# Altium schematic sheet INCAM.SchDoc
size A4
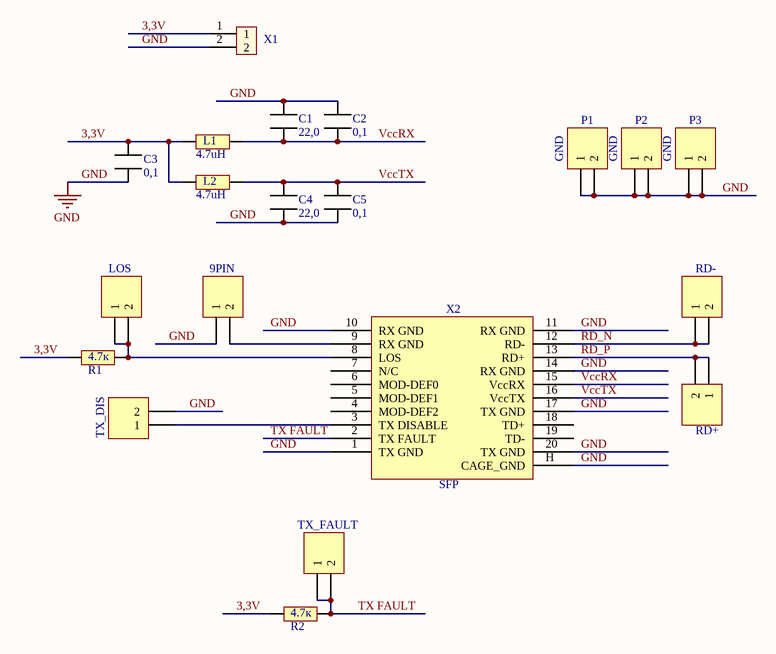
[diagram p0: INCAM.SchDoc]

## Parts
9PIN  Header 2  [HDR1X2]  (value not drawn)
C1  22,0  [Cap_BIG]
C2  0,1  [CAP_SMALL]
C3  0,1  [CAP_SMALL]
C4  22,0  [Cap_BIG]
C5  0,1  [CAP_SMALL]
L1  4.7uH  [RES]
L2  4.7uH  [RES]
LOS  Header 2  [HDR1X2]  (value not drawn)
P1  GND  [HDR1X2]
P2  GND  [HDR1X2]
P3  GND  [HDR1X2]
R1  4.7к  [RES]
R2  4.7к  [RES]
RD+  Header 2  [HDR1X2]  (value not drawn)
RD-  Header 2  [HDR1X2]  (value not drawn)
TX_DIS  Header 2  [HDR1X2]  (value not drawn)
TX_FAULT  Header 2  [HDR1X2]  (value not drawn)
X1  KL_2  [KLEMMNIK_2]  (value not drawn)
X2  SFP  [SFP-20pin]

## Nets
GND: 9PIN.1 C1.2 C2.2 C3.1 C4.1 C5.1 P1.1 P1.2 P2.1 P2.2 P3.1 P3.2 TX_DIS.2 X1.2 X2.1(TX_GND) X2.10(RX_GND) X2.11(RX_GND) X2.14(RX_GND) X2.17(TX_GND) X2.20(TX_GND) X2.H(CAGE_GND)
3,3V: C3.2 L1.1 L2.1 R1.1 R2.1 X1.1
RD_N: RD-.1 RD-.2 X2.12(RD-)
RD_P: RD+.1 RD+.2 X2.13(RD+)
TX FAULT: R2.2 TX_FAULT.1 TX_FAULT.2 X2.2(TX_FAULT)
VccRX: C1.1 C2.1 L1.2 X2.15(VccRX)
VccTX: C4.2 C5.2 L2.2 X2.16(VccTX)
Net9PIN_2: 9PIN.2 X2.9(RX_GND)
NetLOS_1: LOS.1 LOS.2 R1.2 X2.8(LOS)
NetTX_DIS_1: TX_DIS.1 X2.3(TX_DISABLE)

Not connected (* = marked no-connect by the designer): X2 4(MOD-DEF2) 5(MOD-DEF1) 6(MOD-DEF0) 7(N/C) 18(TD+) 19(TD-)

## Library data of the parts
9PIN LOS P1-P3 RD+ RD- TX_DIS TX_FAULT = Header 2: Header, 2-Pin; LatestRevisionDate: 17-Jul-2002; LatestRevisionNote: Re-released for DXP Platform.; Publisher: Altium Limited
C1 C4 = CAP_BIG
C2 C3 C5 = CAP_SMALL
L1 L2 R1 R2 = RES
X1 = KLEMMNIK_2
X2 = SFP-20pin